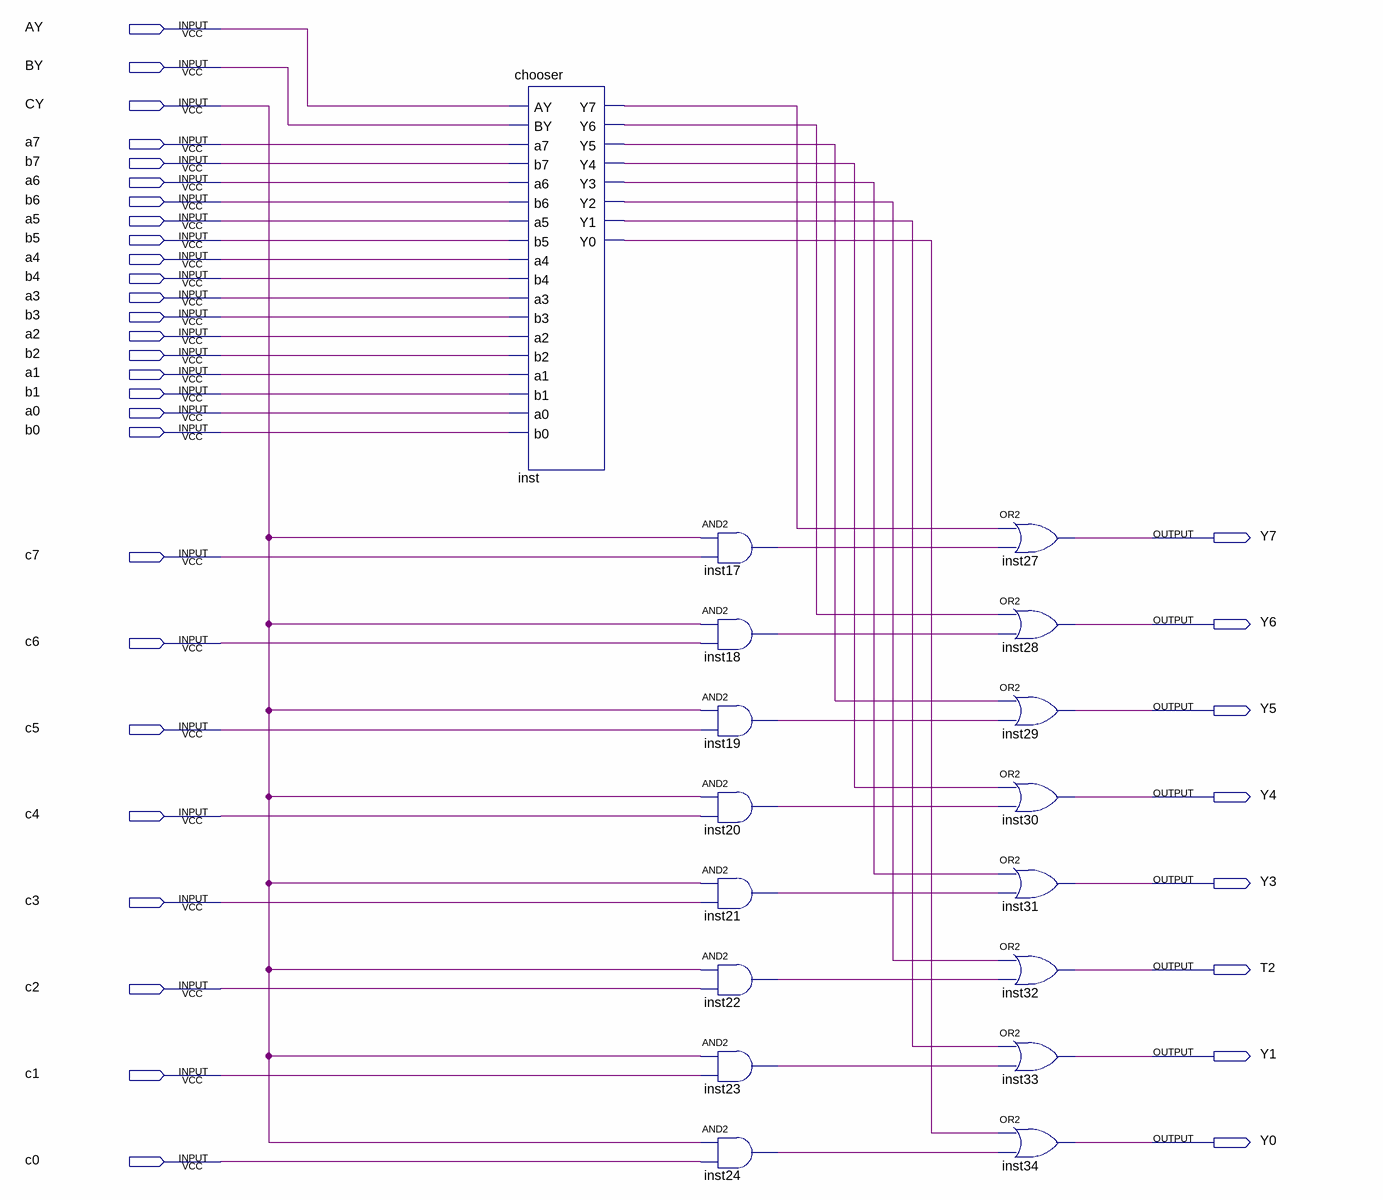
[diagram p0: schematic sheet]
// Quartus schematic chooser-3.bdf as structural Verilog: 17 symbols, 35 pins
module \chooser-3  (
  input  AY,
  input  BY,
  input  CY,
  input  a7,
  input  b7,
  input  a6,
  input  b6,
  input  a5,
  input  b5,
  input  a4,
  input  b4,
  input  a3,
  input  b3,
  input  a2,
  input  b2,
  input  a1,
  input  b1,
  input  a0,
  input  b0,
  input  c7,
  input  c6,
  input  c5,
  input  c4,
  input  c3,
  input  c2,
  input  c1,
  input  c0,
  output Y7,
  output Y6,
  output Y5,
  output Y4,
  output Y3,
  output T2,
  output Y1,
  output Y0
);

  wire inst17_out, inst18_out, inst19_out, inst20_out, inst21_out, inst22_out, inst23_out, inst24_out,
       inst_y0, inst_y1, inst_y2, inst_y3, inst_y4, inst_y5, inst_y6, inst_y7;

  chooser inst (
    .AY(AY), .BY(BY), .a7(a7), .b7(b7), .a6(a6), .b6(b6), .a5(a5), .b5(b5), .a4(a4), .b4(b4), .a3(a3),
    .b3(b3), .a2(a2), .b2(b2), .a1(a1), .b1(b1), .a0(a0), .b0(b0), .Y7(inst_y7), .Y6(inst_y6), .Y5(inst_y5),
    .Y4(inst_y4), .Y3(inst_y3), .Y2(inst_y2), .Y1(inst_y1), .Y0(inst_y0));
  and inst17 (inst17_out, CY, c7);
  and inst18 (inst18_out, CY, c6);
  and inst19 (inst19_out, CY, c5);
  and inst20 (inst20_out, CY, c4);
  and inst21 (inst21_out, CY, c3);
  and inst22 (inst22_out, CY, c2);
  and inst23 (inst23_out, CY, c1);
  and inst24 (inst24_out, CY, c0);
  or inst27 (Y7, inst_y7, inst17_out);
  or inst28 (Y6, inst_y6, inst18_out);
  or inst29 (Y5, inst_y5, inst19_out);
  or inst30 (Y4, inst_y4, inst20_out);
  or inst31 (Y3, inst_y3, inst21_out);
  or inst32 (T2, inst_y2, inst22_out);
  or inst33 (Y1, inst_y1, inst23_out);
  or inst34 (Y0, inst_y0, inst24_out);
endmodule
